# Altium schematic sheet Pulser.SchDoc
size B
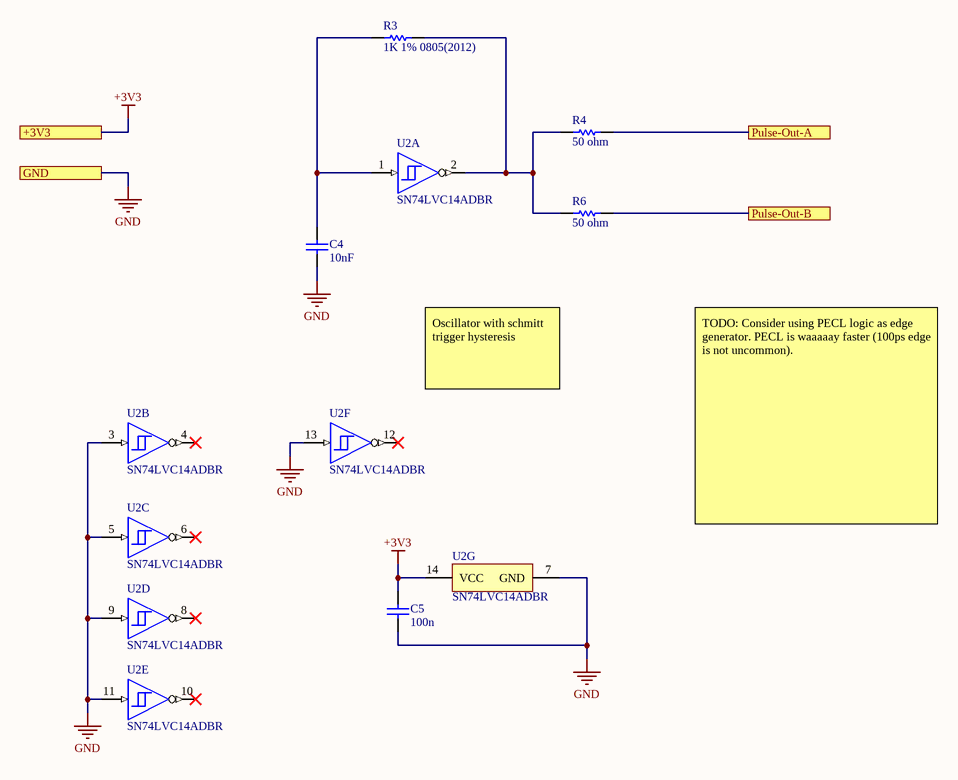
[diagram p0: Pulser.SchDoc]

## Parts
C4  10nF  [CAPC2013X88X50LL20T25]
C5  value 100n  [CAPC2013X88X50NL20T25]  (hidden comment: C0805C104K5RACTU)
R3  1K 1% 0805(2012)  [RESC0805(2012)_M]
R4  50 ohm  [RESC1609X50X30NL10T20]
R6  50 ohm  [RESC1609X50X30NL10T20]
U2  SN74LVC14ADBR  [DB0014A_M]  (parts A,B,C,D,E,F,G of 7)

## Ports
+3V3, GND, Pulse-Out-A, Pulse-Out-B

## Nets
+3V3: C5.2 U2.14(VCC) ; port +3V3
GND: C4.1 C5.1 U2.3(2A) U2.5(3A) U2.7(GND) U2.9(4A) U2.11(5A) U2.13(6A) ; port GND
Pulse-Out-A: R4.2 ; port Pulse-Out-A
Pulse-Out-B: R6.2 ; port Pulse-Out-B
NetC4_2: C4.2 R3.1 U2.1(1A)
NetR3_2: R3.2 R4.1 R6.1 U2.2(~{1Y})

Not connected (* = marked no-connect by the designer): U2 4(~{2Y})* 6(~{3Y})* 8(~{4Y})* 10(~{5Y})* 12(~{6Y})*

## Notes on the sheet
- Oscillator with schmitt trigger hysteresis
- TODO: Consider using PECL logic as edge generator. PECL is waaaaay faster (100ps edge is not uncommon).

## Library data of the parts
C4 = CMP-2007-00493-1: Part Number: C0805C103J3GACTU; Manufacturer: Kemet
C5 = CMP-2007-00279-1: Manufacturer: Kemet; Part Number: C0805C104K5RACTU
R3 = CMP-1013-00510-1: 1K 0.125W 1% 0805 (2012 Metric)  SMD; Case-Metric: 2012; Value: 1000.00 Ohm; Case-EIA: 0805; Tolerance: 1 %; Power: 0.125 W; Technology: SMT
R4 R6 = CMP-2000-03436-1: Part Number: CRCW060350R0FKEA; Manufacturer: Vishay Dale
U2 = CMP-1615-00327-3: Hex Schmitt-Trigger Inverter, DB0014A, LARGE T&R; Manufacturer: Texas Instruments; tpd @ Nom Voltage(Max)(ns): 11,7.8,7.5,6.4; Output Type: CMOS; Voltage(Nom)(V): 1.8,2.5,2.7,3.3; F @ Nom Voltage(Max)(Mhz): 100; ICC @ Nom Voltage(Max)(mA): 0.01; Input Type: CMOS,TTL; VCC(Max)(V): 3.6; Schmitt Trigger: Yes; Technology Family: LVC; VCC(Min)(V): 2; Output Drive (IOL/IOH)(Max)(mA): -24/24; Bits(#): 6; Rating: Catalog; Code_JEDEC: MO-150; PackageReference: DB0014A; Generic Part Number: SN74LVC14A; Operating Temperature Range(C): -40 to 125; DatasheetVersion: SCAS285AA